# Altium project SLAP Board.PrjPcb
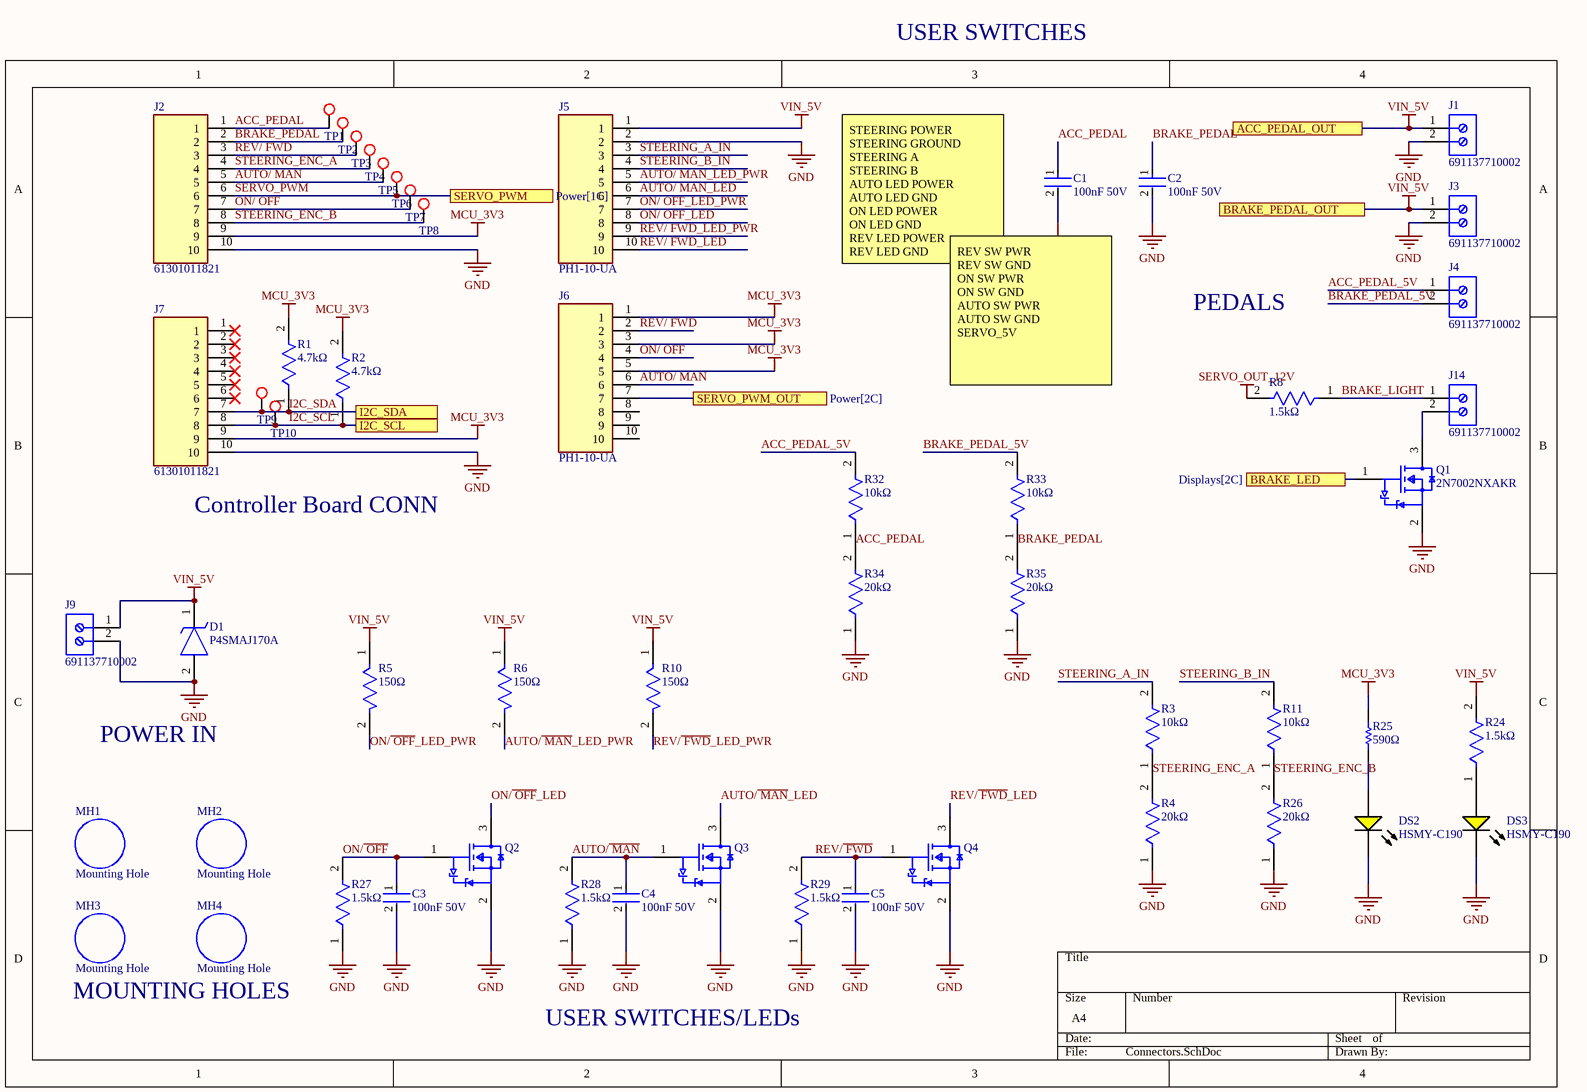
[diagram p0: Connectors.SchDoc]
3 sheets, 91 parts. Net scope: flat (ports and power ports of the same name join across sheets).
Board file: PCB1.PcbDoc
Sheets:
  Connectors.SchDoc
  Power.SchDoc
  Displays.SchDoc

## Sheet Connectors.SchDoc
size A4; SheetNumber: 1; SheetTotal: 3

### Parts
C1  100nF 50V  [FP-CL31-IPC_C]
C2  100nF 50V  [FP-CL31-IPC_C]
C3  100nF 50V  [FP-CL31-IPC_C]
C4  100nF 50V  [FP-CL31-IPC_C]
C5  100nF 50V  [FP-CL31-IPC_C]
D1  P4SMAJ170A  [DIOM5027X240N]
DS2  HSMY-C190  [AVAG-HSMX-C190_V]
DS3  HSMY-C190  [AVAG-HSMX-C190_V]
J1  691137710002  [691137710002]
J2  61301011821  [RHDR10W60P0X254_1X10_2590X250X850P]
J3  691137710002  [691137710002]
J4  691137710002  [691137710002]
J5  PH1-10-UA  [HDRV10W64P0X254_1X10_2540X249X886P]
J6  PH1-10-UA  [HDRV10W64P0X254_1X10_2540X249X886P]
J7  61301011821  [RHDR10W60P0X254_1X10_2590X250X850P]
J9  691137710002  [691137710002]
J14  691137710002  [691137710002]
MH1  Mounting Hole  [Mounting Hole]
MH2  Mounting Hole  [Mounting Hole]
MH3  Mounting Hole  [Mounting Hole]
MH4  Mounting Hole  [Mounting Hole]
Q1  2N7002NXAKR  [FP-SOT23-IPC_B]
Q2  2N7002NXAKR  [FP-SOT23-IPC_B]  (value not drawn)
Q3  2N7002NXAKR  [FP-SOT23-IPC_B]  (value not drawn)
Q4  2N7002NXAKR  [FP-SOT23-IPC_B]  (value not drawn)
R1  4.7kΩ  [FP-RT0805-MFG]
R2  4.7kΩ  [FP-RT0805-MFG]
R3  10kΩ  [FP-RT0603-MFG]
R4  20kΩ  [FP-RT0805-MFG]
R5  150Ω  [FP-RT0603-MFG]
R6  150Ω  [FP-RT0603-MFG]
R8  1.5kΩ  [FP-CRCW0603-e3-IPC_A]  (no BOM)
R10  150Ω  [FP-RT0603-MFG]
R11  10kΩ  [FP-RT0603-MFG]
R24  1.5kΩ  [FP-RC1608-IPC_B]
R25  590Ω  [RESC1608X55X25ML10T15]
R26  20kΩ  [FP-RT0805-MFG]
R27  1.5kΩ  [FP-CRCW0603-e3-IPC_A]
R28  1.5kΩ  [FP-CRCW0603-e3-IPC_A]
R29  1.5kΩ  [FP-CRCW0603-e3-IPC_A]
R32  10kΩ  [FP-RT0603-MFG]
R33  10kΩ  [FP-RT0603-MFG]
R34  20kΩ  [FP-RT0805-MFG]
R35  20kΩ  [FP-RT0805-MFG]
TP1  TP  [Testpoint]  (value not drawn)
TP2  TP  [Testpoint]  (value not drawn)
TP3  TP  [Testpoint]  (value not drawn)
TP4  TP  [Testpoint]  (value not drawn)
TP5  TP  [Testpoint]  (value not drawn)
TP6  TP  [Testpoint]  (value not drawn)
TP7  TP  [Testpoint]  (value not drawn)
TP8  TP  [Testpoint]  (value not drawn)
TP9  TP  [Testpoint]  (value not drawn)
TP10  TP  [Testpoint]  (value not drawn)

### Ports
ACC_PEDAL_OUT, BRAKE_LED (see Displays[2C]), BRAKE_PEDAL_OUT, I2C_SCL (see Displays[1A], Displays[2C]), I2C_SDA (see Displays[1A], Displays[2C]), SERVO_PWM (see Power[1C]), SERVO_PWM_OUT (see Power[2C])

### Nets
GND: C1.2 C2.2 C3.2 C4.2 C5.2 D1.2(A) DS2.2(K) DS3.2(K) J1.2 J2.10 J3.2 J5.2 J7.10 J9.2 Q1.2(S) Q2.2(S) Q3.2(S) Q4.2(S) R4.1 R26.1 R27.1 R28.1 R29.1 R34.1 R35.1
MCU_3V3: J2.9 J6.1 J6.3 J6.5 J7.9 R1.2 R2.2 R25.2
SERVO_OUT_12V: R8.2
VIN_5V: D1.1(K) J1.1 J3.1 J5.1 J9.1 R5.1 R6.1 R10.1 R24.2 ; port ACC_PEDAL_OUT, port BRAKE_PEDAL_OUT
ACC_PEDAL: C1.1 J2.1 R32.1 R34.2 TP1.0
ACC_PEDAL_5V: J4.1 R32.2
AUTO/~{ MAN}: C4.1 J2.5 J6.6 Q3.1(G) R28.2 TP5.0
AUTO/~{ MAN}_LED: J5.6 Q3.3(D)
AUTO/~{ MAN}_LED_PWR: J5.5 R6.2
BRAKE_LED: Q1.1(G) ; port BRAKE_LED
BRAKE_LIGHT: J14.1 R8.1
BRAKE_PEDAL: C2.1 J2.2 R33.1 R35.2 TP2.0
BRAKE_PEDAL_5V: J4.2 R33.2
I2C_SCL: J7.8 R2.1 TP10.0 ; port I2C_SCL
I2C_SDA: J7.7 R1.1 TP9.0 ; port I2C_SDA
ON/~{ OFF}: C3.1 J2.7 J6.4 Q2.1(G) R27.2 TP7.0
ON/~{ OFF}_LED: J5.8 Q2.3(D)
ON/~{ OFF}_LED_PWR: J5.7 R5.2
REV/~{ FWD}: C5.1 J2.3 J6.2 Q4.1(G) R29.2 TP3.0
REV/~{ FWD}_LED: J5.10 Q4.3(D)
REV/~{ FWD}_LED_PWR: J5.9 R10.2
SERVO_PWM: J2.6 TP6.0 ; port SERVO_PWM
STEERING_A_IN: J5.3 R3.2
STEERING_B_IN: J5.4 R11.2
STEERING_ENC_A: J2.4 R3.1 R4.2 TP4.0
STEERING_ENC_B: J2.8 R11.1 R26.2 TP8.0
NetDS2_1: DS2.1(A) R25.1
NetDS3_1: DS3.1(A) R24.1
NetIC2_4: J6.7 ; port SERVO_PWM_OUT
NetJ14_2: J14.2 Q1.3(D)

Not connected (* = marked no-connect by the designer): J6 8 9 10; J7 1* 2* 3* 4* 5* 6*

### Notes on the sheet
- USER SWITCHES
- STEERING POWER
  STEERING GROUND
  STEERING A
  STEERING B
  AUTO LED POWER
  AUTO LED GND
  ON LED POWER
  ON LED GND
  REV LED POWER
  REV LED GND
- PEDALS
- REV SW PWR
  REV SW GND
  ON SW PWR
  ON SW GND
  AUTO SW PWR
  AUTO SW GND
  SERVO_5V
- (near J7) Controller Board CONN
- POWER IN
- MOUNTING HOLES
- USER SWITCHES/LEDs

### Library data of the parts
C1-C5 = CMP-13271-001276-1: Cap Ceramic 100nF 50V X7R ±10% SMD 1206 +125°C Embossed T/R; Dielectric: X7R; Case Code (Metric): 3216; Package Quantity: 1; Thickness: 0.037inch; Depth: 1.6mm; Packaging: Tape and Reel; Capacitance: 100nF; Length: 0.126inch; Tolerance: 10%; Voltage Rating: 50V; Case Code (Imperial): 1206; Radiation Hardening: No; Width: 0.063inch; Case/Package: 1206; Max Operating Temperature: 125°C; Min Operating Temperature: -55°C; Height: 0.85mm; Mount: Surface Mount
D1 = P4SMAJ170A: TVS Diode (Uni-directional); Manufacturer_Name: Diotec; Datasheet Link: https://diotec.com/request/datasheet/p4smaj65.pdf; Height: 2.4mm; Manufacturer_Part_Number: P4SMAJ170A
DS2 DS3 = CMP-1744-00003-1: LED Uni-Color Yellow, 65 mW, 20 mA, -40 to 85 degC, 2-Pin SMD, RoHS, Tape and Reel; Tolerance: 1%; Voltage Rating: 50 V; Power Rating: 100 mW; Case\Package: 0603; Resistance: 390 Ohm; Min Operating Temperature: -55 degC; Length: 1.6 mm; ComponentLink3Description: Package Specification; Mount: Surface Mount; PackageReference: HSMX-C190; ComponentLink2Description: Datasheet; DatasheetVersion: Mar-12; Case Code (Metric): 1608; Pins: 2; Package Quantity: 5000; ComponentLink2URL: http://docs.avagotech.com/docs/AV02-0551EN; ComponentLink1Description: Manufacturer URL; RoHSCompliant: true; Packaging: Tape and Reel; PackageDescription: 2-Pin Surface Mount Device, Body 1.6 x 0.8 mm, Height 0.9 mm; REACH SVHC: No SVHC; ComponentLink3URL: http://www.fairchildsemi.com/dwg/MA/MA03D.pdf; Voltage Rating (DC): 50 V; Width: 0.8 mm; ComponentLink1URL: http://www.avagotech.com/; Max Operating Temperature: 155 degC; Case Code (Imperial): 0603; Height: 0.45 mm
J1 J3 J4 J9 J14 = CMP-1502-03324-2: NexarPartId: 78871135; Voltage Rating: 300V; Number of Contacts: 2; Current Rating: 16A; Lead Pitch: 5mm; Height: 11.6mm; Packaging: Box; RoHS: Non-Compliant; Contact Material: Nickel, Tin; Max Operating Temperature: 120°C; Number of Pins: 2; Min Operating Temperature: -30°C; Number of Rows: 1
J2 J7 = 61301011821: Connector; Manufacturer_Name: Wurth Elektronik; Datasheet Link: http://katalog.we-online.de/em/datasheet/6130xx11821.pdf; Height: 8.5mm; Manufacturer_Part_Number: 61301011821; Mouser Part Number: 710-61301011821; Mouser Price/Stock: https://www.mouser.co.uk/ProductDetail/Wurth-Elektronik/61301011821?qs=W%252B2sBeLta1ZhlLR0YCzonQ%3D%3D
J5 J6 = PH1-10-UA: Connector; Manufacturer_Name: Adam Tech; Datasheet Link: https://app.adam-tech.com/products/download/data_sheet/201605/ph1-xx-ua-data-sheet.pdf; Height: 8.865mm; Manufacturer_Part_Number: PH1-10-UA; Mouser Part Number: 737-PH1-10-UA; Mouser Price/Stock: https://www.mouser.co.uk/ProductDetail/Adam-Tech/PH1-10-UA?qs=ogqIPVdloe%252Bff9mnAAAy9w%3D%3D; Arrow Part Number: PH1-10-UA; Arrow Price/Stock: null?utm_currency=USD&region=nac
Q1-Q4 = CMP-14409-000026-2: 2N7002NXAK/SOT23/TO-236AB
R1 R2 = CMP-03412-019393-1: RES SMD 4.7K OHM 1% 1/8W 0805; Manufacturer Part Number: RT0805FRE074K7L; Manufacturer: Yageo; Tolerance: 0.0001; Power Rating: 0.125W; Voltage Rating: 150V; Temperature Coefficient: 50 ppm/°C; Device Class L1: Passive Components; Category: Res; Temperature Range Low: -55°C; Device Class L2: Resistors; Ipc Land Pattern Name: RESC200125X50; Package: RT0805; Device Class L3: Chip SMD Resistors; Temperature: -55°C to +155°C; ComponentLink2Description: Datasheet; Footprint Url: http://www.yageo.com/exep/pages/download/literatures/PYu-R_Mount_10.pdf; Series: RT; Mouser Description: Thin Film Resistors - SMD 1/8W 4.7K ohm 1% 50ppm; Height: 0.6mm; Resistance: 4.7KΩ; Octopart: https://octopart.com/rt0805fre074k7l-yageo-40047233; Value: 4.7KΩ; Digikey Description: RES SMD 4.7K OHM 1% 1/8W 0805; Composition: Thin Film; Automotive: No; Temperature Range High: +155°C; Lead Free: Yes; ComponentLink2URL: http://www.yageo.com/documents/recent/PYu-RT_1-to-0.01_RoHS_L_9.pdf; RoHS: TRUE
R3 R11 R32 R33 = CMP-2000-04517-2: RES SMD 10K OHM 0.1% 1/10W 0603; Manufacturer Part Number: RT0603BRE0710KL; Manufacturer: Yageo; Tolerance: 0.001; Temperature Coefficient: 50 ppm/°C; Power Rating: 0.1W; Voltage Rating: 75V; Temperature Range High: +155°C; Device Class L2: Resistors; Temperature: -55°C to +155°C; Series: RT; Device Class L1: Passive Components; Temperature Range Low: -55°C; Automotive: No; Mouser Description: Res Thin Film 0603 10K Ohm 0.1% 1/10W ±50ppm/°C Molded SMD SMD Paper T/R; Device Class L3: Chip SMD Resistors; RoHS: TRUE; Package: RT0603; Footprint Url: http://www.yageo.com/exep/pages/download/literatures/PYu-R_Mount_10.pdf; Octopart: https://octopart.com/rt0603bre0710kl-yageo-1273959; ComponentLink2URL: http://www.yageo.com/documents/recent/PYu-RT_1-to-0.01_RoHS_L_9.pdf; Composition: Thin Film; Category: Res; Lead Free: Yes; Resistance: 10KΩ; Height: 0.55mm; Digikey Description: RES SMD 10K OHM 0.1% 1/10W 0603; Ipc Land Pattern Name: RESC16080X45; Value: 10KΩ; ComponentLink2Description: Datasheet
R4 R26 R34 R35 = CMP-2001-01463-2: RES SMD 20K OHM 1% 1/8W 0805; Manufacturer: Yageo; Manufacturer Part Number: RT0805FRE0720KL; Power Rating: 0.125W; Voltage Rating: 150V; Tolerance: 0.0001; Temperature Coefficient: 50 ppm/°C; Height: 0.6mm; Lead Free: Yes; Device Class L3: Chip SMD Resistors; Series: RT; ComponentLink2URL: http://www.yageo.com/documents/recent/PYu-RT_1-to-0.01_RoHS_L_9.pdf; Footprint Url: http://www.yageo.com/exep/pages/download/literatures/PYu-R_Mount_10.pdf; Value: 20KΩ; Mouser Description: Thin Film Resistors - SMD 1/8W 20K ohm 1% 50ppm; Device Class L2: Resistors; Device Class L1: Passive Components; RoHS: TRUE; ComponentLink2Description: Datasheet; Category: Res; Package: RT0805; Digikey Description: RES SMD 20K OHM 1% 1/8W 0805; Temperature Range High: +155°C; Ipc Land Pattern Name: RESC200125X50; Temperature Range Low: -55°C; Octopart: https://octopart.com/rt0805fre0720kl-yageo-1410620; Resistance: 20KΩ; Temperature: -55°C to +155°C; Composition: Thin Film; Automotive: No
R5 R6 R10 = CMP-03412-008371-1: RES SMD 150 OHM 1% 1/10W 0603; Manufacturer Part Number: RT0603FRE07150RL; Manufacturer: Yageo; Voltage Rating: 75V; Power Rating: 0.1W; Tolerance: 0.01; Temperature Coefficient: 50 ppm/°C; Digikey Description: RES SMD 150 OHM 1% 1/10W 0603; Device Class L3: Chip SMD Resistors; Category: Res; Automotive: No; Octopart: https://octopart.com/rt0603fre07150rl-yageo-39804552; Ipc Land Pattern Name: RESC16080X45; RoHS: TRUE; Composition: Thin Film; Lead Free: Yes; Temperature: -55°C to +155°C; Footprint Url: http://www.yageo.com/exep/pages/download/literatures/PYu-R_Mount_10.pdf; ComponentLink2URL: http://www.yageo.com/documents/recent/PYu-RT_1-to-0.01_RoHS_L_9.pdf; Device Class L1: Passive Components; ComponentLink2Description: Datasheet; Device Class L2: Resistors; Temperature Range Low: -55°C; Height: 0.55mm; Resistance: 150Ω; Package: RT0603; Series: RT; Temperature Range High: +155°C; Mouser Description: Thin Film Resistors - SMD 1/10W 150 ohm 1% 50ppm; Value: 150Ω
R8 R27-R29 = CMP-2000-02995-2: RES Thick Film, 1.5kΩ, 1%, 0.1W, 100ppm/°C, 0603; Working Voltage: 75V; Power Rating: 100mW; Resistance: 1.5kR; Max Operating Temperature: 155°C; Features: Automotive AEC-Q200; Min Operating Temperature: -55°C; Width: 0.033inch; Case/Package: 0603; Voltage Rating (DC): 75V; Termination: SMD/SMT; Mount: Surface Mount; Weight: 7.1E-05oz; Case Code (Metric): 1608; Height: 0.45mm; Voltage Rating: 75V; Length: 1.55mm; Package Quantity: 10; Lead Free: Lead Free; Composition: Thick Film; Packaging: Tape and Reel; Temperature Coefficient: 100ppm/°C; Tolerance: 1%; Military Standard: Not; Case Code (Imperial): 0603; Number of Terminations: 2; Max Power Dissipation: 100mW; Depth: 0.85mm; Contact Plating: Tin
R24 = CMP-13261-004935-1: Res Thick Film 0603 1.5kΩ 1% 0.1W ±100ppm/°C Molded SMD T/R; Resistance: 1.5kR; Voltage Rating (DC): 50V; Power Rating: 100mW; Contact Plating: Tin; Depth: 0.8mm; Width: 800um; Tolerance: 1%; Lead Free: Lead Free; Composition: Thick Film; Military Standard: Not; Temperature Coefficient: 100ppm/°C; Radiation Hardening: No; Length: 1.6mm; Case/Package: 0603; Max Operating Temperature: 155°C; Packaging: Tape and Reel; Min Operating Temperature: -55°C
R25 = CMP-2000-04089-1: Part Number: RC0603FR-07590RL; Manufacturer: Yageo
TP1-TP10 = Testpoint

## Sheet Power.SchDoc
size A4; SheetNumber: 2; SheetTotal: 3
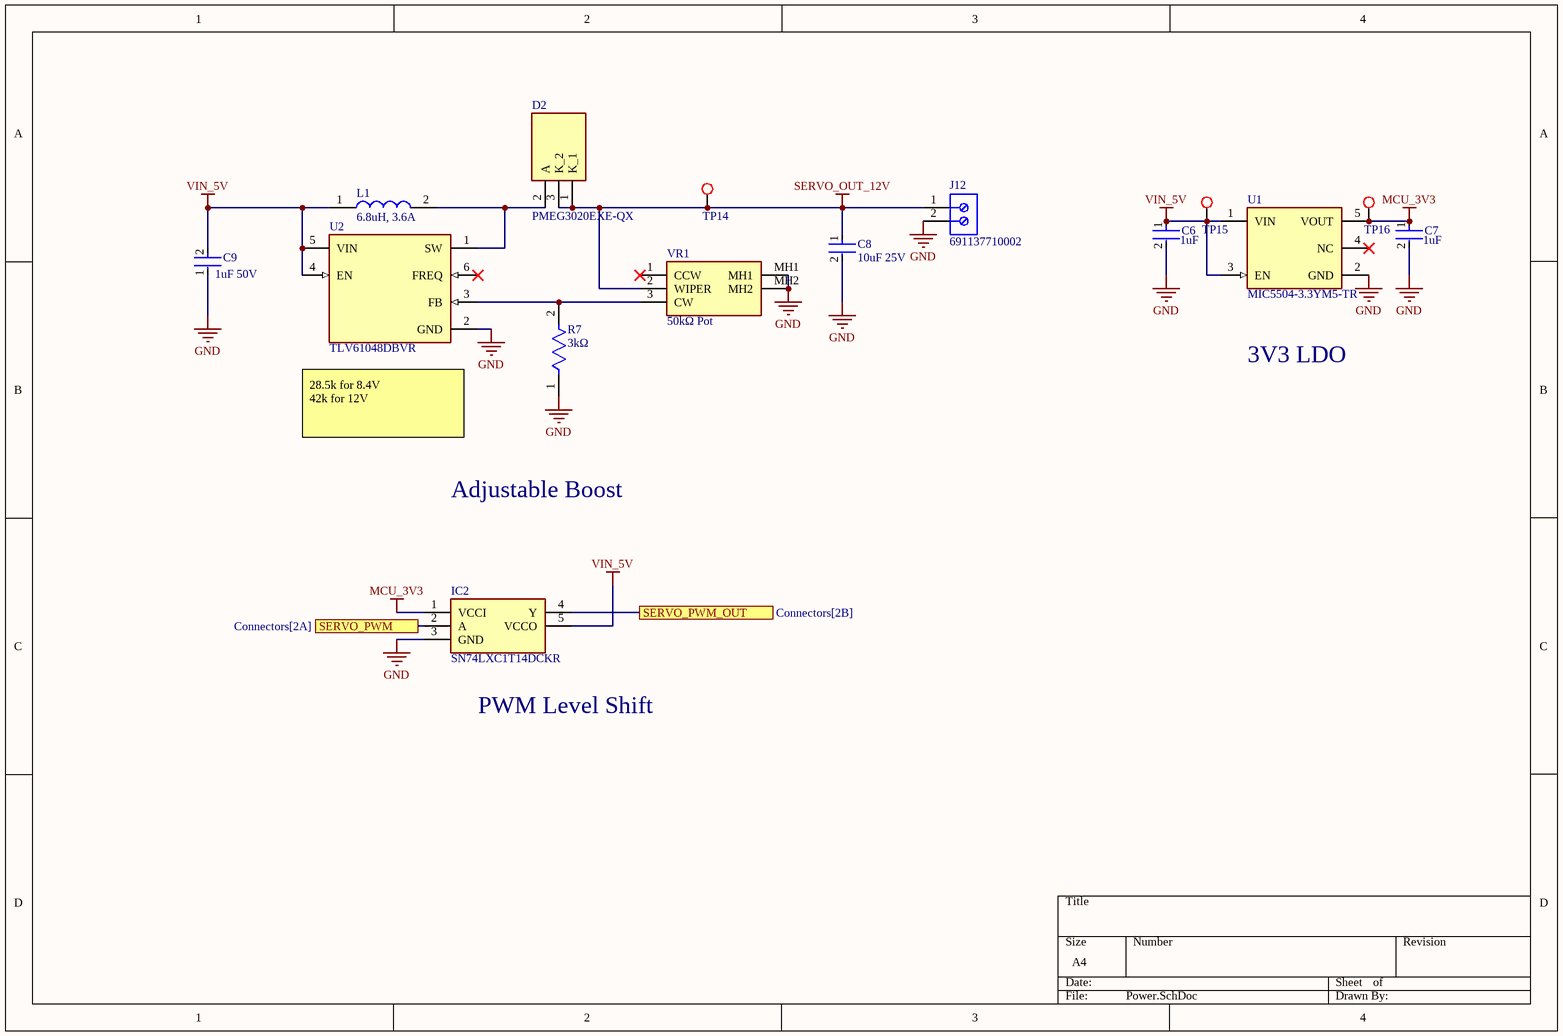
[diagram p1: Power.SchDoc]

### Parts
C6  1uF  [FP-CL10-IPC_C]
C7  1uF  [FP-CL10-IPC_C]
C8  10uF 25V  [FP-CL31-IPC_B]
C9  1uF 50V  [FP-C1608-080-0_1-IPC_B]
D2  PMEG3020EXE-QX  [PMEG4010EXEX]
IC2  SN74LXC1T14DCKR  [SOT65P210X110-5N]
J12  691137710002  [691137710002]
L1  6.8uH, 3.6A  [VLS6045]
R7  3kΩ  [FP-RG2012-IPC_A]
TP14  TP  [Testpoint]  (value not drawn)
TP15  TP  [Testpoint]  (value not drawn)
TP16  TP  [Testpoint]  (value not drawn)
U1  MIC5504-3.3YM5-TR  [FP-SOT23-5LD-PL-1-MFG]
U2  TLV61048DBVR  [FP-DBV0006A-IPC_B]
VR1  50kΩ Pot  [PTV09A4030SA503]

### Ports
SERVO_PWM (see Connectors[2A]), SERVO_PWM_OUT (see Connectors[2B])

### Nets
GND: C6.2 C7.2 C8.2 C9.1 IC2.3(GND) J12.2 R7.1 U1.2(GND) U2.2(GND) VR1.MH1 VR1.MH2
MCU_3V3: C7.1 IC2.1(VCCI) TP16.0 U1.5(VOUT)
SERVO_OUT_12V: C8.1 D2.1(K_1) D2.3(K_2) J12.1 TP14.0 VR1.2(WIPER)
VIN_5V: C6.1 C9.2 IC2.5(VCCO) L1.1 TP15.0 U1.1(VIN) U1.3(EN) U2.4(EN) U2.5(VIN)
SERVO_PWM: IC2.2(A) ; port SERVO_PWM
NetD2_2: D2.2(A) L1.2 U2.1(SW)
NetIC2_4: IC2.4(Y) ; port SERVO_PWM_OUT
NetR7_2: R7.2 U2.3(FB) VR1.3(CW)

Not connected (* = marked no-connect by the designer): U1 4(NC)*; U2 6(FREQ)*; VR1 1(CCW)*

### Notes on the sheet
- 3V3 LDO
- (near U2) 28.5k for 8.4V
  42k for 12V
- Adjustable Boost
- PWM Level Shift

### Library data of the parts
C6 C7 = CMP-13271-003399-1: Cap Ceramic 1uF 10V X5R ±10% Pad SMD 0603 +85°C T/R; Min Operating Temperature: -55°C; Max Operating Temperature: 85°C; Dielectric: X5R; Contact Plating: Tin; Height: 0.8mm; Voltage: 10V; Packaging: Tape and Reel; Voltage Rating: 10V; Capacitance: 1uF; Package Quantity: 1; Width: 0.031inch; Length: 1.6mm; Depth: 0.8mm; Case/Package: 0603; Case Code (Imperial): 0603; Thickness: 0.035inch; Radiation Hardening: No; Tolerance: 10%; Case Code (Metric): 1608; Mount: Surface Mount
C8 = CMP-13271-001434-1: Cap Ceramic 10uF 25V X7R ±10% SMD 1206 +125°C Embossed T/R; Max Operating Temperature: 125°C; Dielectric: X7R; Voltage Rating: 25V; Tolerance: 10%; Min Operating Temperature: -55°C; Height: 1.6mm; Mount: Surface Mount; Width: 0.063inch; Thickness: 0.071inch; Case Code (Metric): 3216; Contact Plating: Tin; Packaging: Tape and Reel; Case/Package: 1206; Capacitance: 10uF; Case Code (Imperial): 1206; Length: 0.126inch; Radiation Hardening: No; Package Quantity: 1; Depth: 1.6mm
C9 = CMP-2000-06025-2: Multilayer Ceramic Capacitors 1μF ±10% 50V X5R SMD 0603; Lead Free: Lead Free; Height: 0.8mm; Mount: Surface Mount; Radiation Hardening: No; Thickness: 0.035inch; Length: 1.6mm; Max Operating Temperature: 85°C; REACH SVHC: No SVHC; Min Operating Temperature: -55°C; Construction: Flat; RoHS Compliant: Yes; Voltage Rating: 50V; Dielectric: X5R; Packaging: Tape and Reel; Termination: SMD/SMT; Voltage Rating (DC): 50V; Case Code (Imperial): 0603; Voltage: 50V; Width: 0.031inch; Weight: 7.1E-05oz; Capacitance: 1uF; Depth: 0.8mm; Case Code (Metric): 1608; Series: C; Case/Package: 0603; Tolerance: 10%; Resistor Type: Ceramic; Number of Pins: 2; Dielectric Material: Ceramic; Package Quantity: 1
D2 = PMEG3020EXE-QX: Schottky Diode; Manufacturer_Name: Nexperia; Datasheet Link: https://assets.nexperia.com/documents/data-sheet/PMEG4010EXE.pdf; Height: 1mm; Manufacturer_Part_Number: PMEG3020EXE-QX; Mouser Part Number: 771-PMEG3020EXE-Q; Mouser Price/Stock: https://www.mouser.co.uk/ProductDetail/Nexperia/PMEG3020EXE-QX?qs=dbcCsuKDzFVlrH7wpIOIMQ%3D%3D
IC2 = SN74LXC1T14DCKR: Integrated Circuit; Manufacturer_Name: Texas Instruments; Datasheet Link: https://www.ti.com/lit/gpn/sn74lxc1t14; Height: 1.1mm; Manufacturer_Part_Number: SN74LXC1T14DCKR; Mouser Part Number: 595-SN74LXC1T14DCKR; Mouser Price/Stock: https://www.mouser.co.uk/ProductDetail/Texas-Instruments/SN74LXC1T14DCKR?qs=tlsG%2FOw5FFhO0IEgLqYGiw%3D%3D; Arrow Part Number: SN74LXC1T14DCKR; Arrow Price/Stock: https://www.arrow.com/en/products/sn74lxc1t14dckr/texas-instruments?region=nac
J12 = CMP-1502-03324-2: as J1 on sheet Connectors; Lead Pitch: 5mm; Height: 11.6mm; Packaging: Box; RoHS: Non-Compliant; Contact Material: Nickel, Tin; Max Operating Temperature: 120°C; Number of Pins: 2; Min Operating Temperature: -30°C; Number of Rows: 1
L1 = VLS6045EX-6R8M: Inductor; Manufacturer_Name: TDK; Datasheet Link: https://product.tdk.com/system/files/dam/doc/product/inductor/inductor/smd/catalog/inductor_commercial_power_vls6045ex_en.pdf; Manufacturer_Part_Number: VLS6045EX-6R8M; Mouser Part Number: 810-VLS6045EX-6R8M; Mouser Price/Stock: https://www.mouser.co.uk/ProductDetail/TDK/VLS6045EX-6R8M?qs=LtAzLad%252BoeXmJR68%2FnJvXA%3D%3D; Arrow Part Number: VLS6045EX-6R8M; Arrow Price/Stock: https://www.arrow.com/en/products/vls6045ex-6r8m/tdk?utm_currency=USD&region=nac
R7 = CMP-2001-02900-2: Automotive Metal Thin Film Chip Resistor, 0805, 3kΩ, 0.1%, 25ppm/°C, 0.125W, 150V; Resistance: 3kR; Max Power Dissipation: 125mW; Voltage Rating: 100V; Power Rating: 100mW; Width: 1.25mm; Case/Package: 0805; Resistor Type: Thin Film; Case Code (Metric): 2012; Min Operating Temperature: -55°C; Series: RG; Length: 0.079inch; Temperature Coefficient: 25ppm/°C; Height: 0.02inch; Number of Terminations: 2; RoHS Compliant: Yes; Termination: SMD/SMT; Packaging: Tape and Reel; Max Operating Temperature: 155°C; Package Quantity: 1; Size Code: 0805; Case Code (Imperial): 0805; Lead Free: Lead Free; Voltage Rating (DC): 150V; Tolerance: 0.1%; Features: Automotive AEC-Q200
TP14-TP16 = Testpoint
U1 = CMP-2000-07604-2: IC REG LINEAR 3.3V 300MA SOT23-5; Quiescent Current: 38uA; Operating Supply Current: 42uA; Max Input Voltage: 5.5V; Min Input Voltage: 2.5V; Output Type: Fixed; Power Supply Rejection Ratio (PSRR): 60dB; Dropout Voltage: 380mV; Accuracy: 3%; Number of Outputs: 1; Nominal Output Voltage: 3.3V; Max Output Current: 300mA; Length: 2.9mm; Mount: Surface Mount; Width: 1.6mm; Packaging: Tape and Reel; Output Current: 300mA; Min Operating Temperature: -40°C; Max Operating Temperature: 125°C; Height: 1.1mm; Case/Package: SOT-23-5; REACH SVHC: No SVHC; Number of Pins: 5; Output Voltage: 3.3V
U2 = CMP-04918-000262-1: IC REG BOOST ADJ SOT23-6
VR1 = PTV09A-4030S-A503: Variable Resistor; Manufacturer_Name: Bourns; Datasheet Link: https://www.bourns.com/docs/Product-Datasheets/PTV09.pdf; Height: 30.5mm; Manufacturer_Part_Number: PTV09A-4030S-A503; Mouser Part Number: 652-PTV09A-4030SA503; Mouser Price/Stock: https://www.mouser.co.uk/ProductDetail/Bourns/PTV09A-4030S-A503?qs=pxDZlBjcsCjgtyjThPtRRg%3D%3D

## Sheet Displays.SchDoc
size A4; SheetNumber: 3; SheetTotal: 3
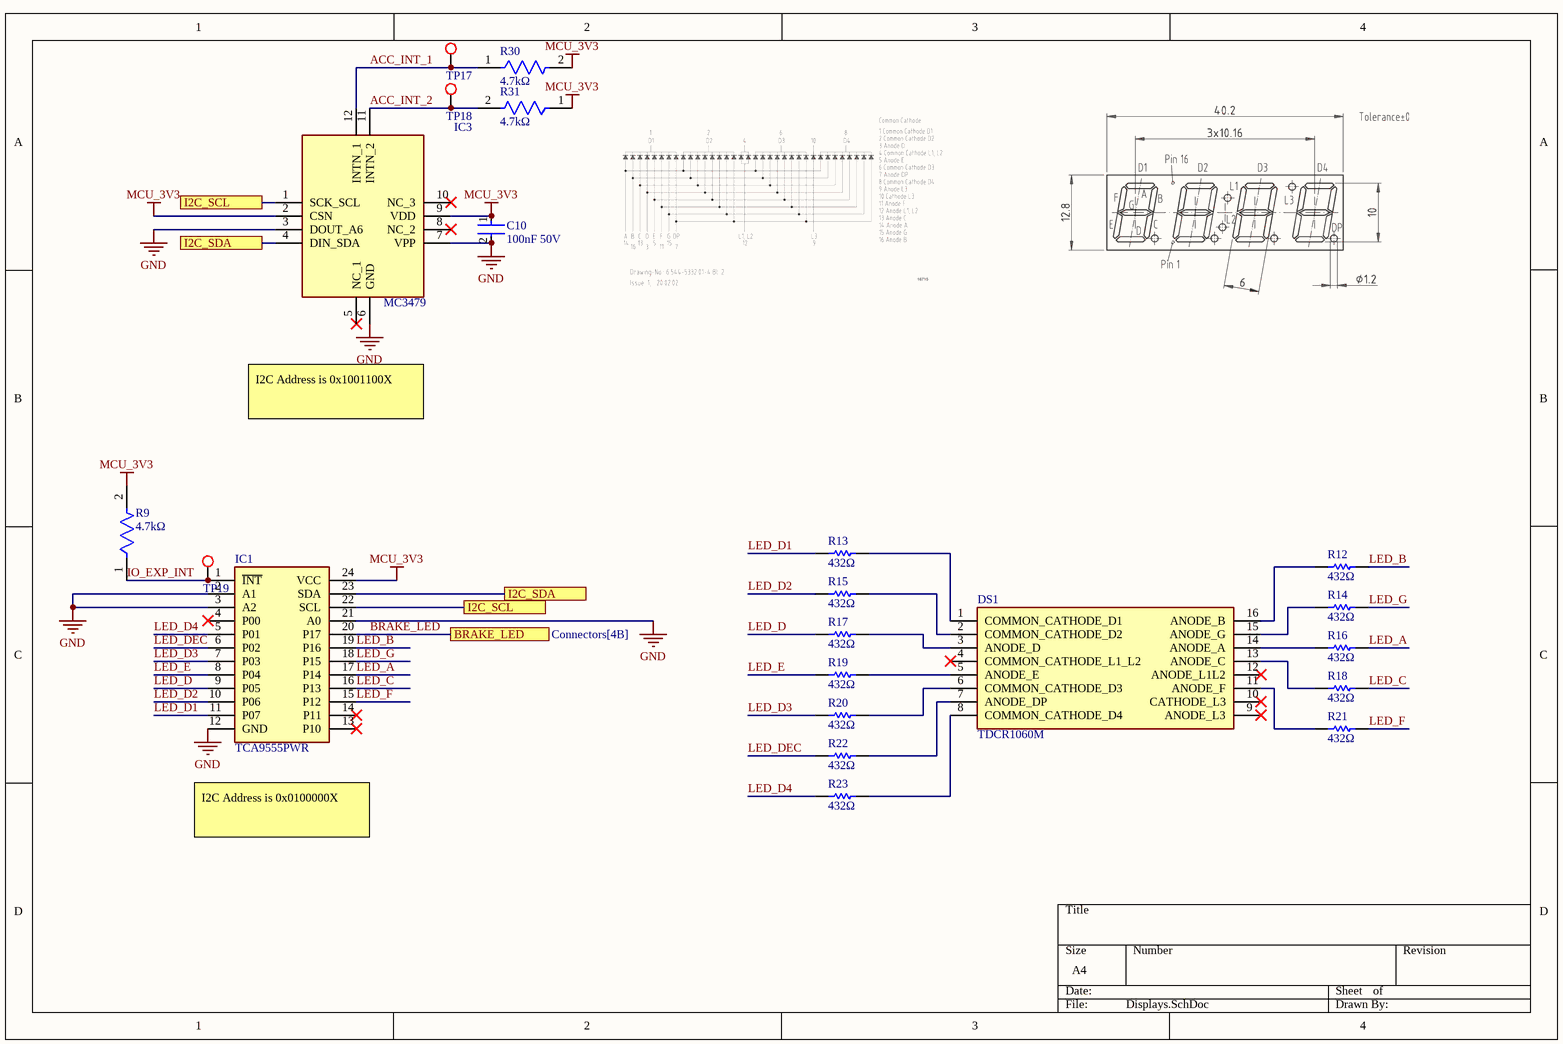
[diagram p2: Displays.SchDoc]

### Parts
C10  100nF 50V  [FP-CL31-IPC_C]
DS1  TDCR1060M  [DIPS1016W50P254L4020H725Q16N]
IC1  TCA9555PWR  [SOP65P640X120-24N]
IC3  MC3479  [MC3479]
R9  4.7kΩ  [FP-RT0805-MFG]
R12  432Ω  [RESC2013X50X30NL20T20]
R13  432Ω  [RESC2013X50X30NL20T20]
R14  432Ω  [RESC2013X50X30NL20T20]
R15  432Ω  [RESC2013X50X30NL20T20]
R16  432Ω  [RESC2013X50X30NL20T20]
R17  432Ω  [RESC2013X50X30NL20T20]
R18  432Ω  [RESC2013X50X30NL20T20]
R19  432Ω  [RESC2013X50X30NL20T20]
R20  432Ω  [RESC2013X50X30NL20T20]
R21  432Ω  [RESC2013X50X30NL20T20]
R22  432Ω  [RESC2013X50X30NL20T20]
R23  432Ω  [RESC2013X50X30NL20T20]
R30  4.7kΩ  [FP-RT0805-MFG]
R31  4.7kΩ  [FP-RT0805-MFG]
TP17  TP  [Testpoint]  (value not drawn)
TP18  TP  [Testpoint]  (value not drawn)
TP19  TP  [Testpoint]  (value not drawn)

### Ports
BRAKE_LED (see Connectors[4B]), I2C_SCL (see Connectors[1B], Displays[1A]), I2C_SCL (see Connectors[1B], Displays[2C]), I2C_SDA (see Connectors[1B], Displays[1A]), I2C_SDA (see Connectors[1B], Displays[2C])

### Nets
GND: C10.2 IC1.2(A1) IC1.3(A2) IC1.12(GND) IC1.21(A0) IC3.3(DOUT_A6) IC3.6(GND) IC3.7(VPP)
MCU_3V3: C10.1 IC1.24(VCC) IC3.2(CSN) IC3.9(VDD) R9.2 R30.2 R31.1
ACC_INT_1: IC3.12(INTN_1) R30.1 TP17.0
ACC_INT_2: IC3.11(INTN_2) R31.2 TP18.0
BRAKE_LED: IC1.20(P17) ; port BRAKE_LED
I2C_SCL: IC1.22(SCL) IC3.1(SCK_SCL) ; port I2C_SCL
I2C_SDA: IC1.23(SDA) IC3.4(DIN_SDA) ; port I2C_SDA
IO_EXP_INT: IC1.1(~{INT}) R9.1 TP19.0
LED_A: IC1.17(P14) R16.2
LED_B: IC1.19(P16) R12.2
LED_C: IC1.16(P13) R18.2
LED_D: IC1.9(P05) R17.1
LED_D1: IC1.11(P07) R13.1
LED_D2: IC1.10(P06) R15.1
LED_D3: IC1.7(P03) R20.1
LED_D4: IC1.5(P01) R23.1
LED_DEC: IC1.6(P02) R22.1
LED_E: IC1.8(P04) R19.1
LED_F: IC1.15(P12) R21.2
LED_G: IC1.18(P15) R14.2
NetDS1_1: DS1.1(COMMON_CATHODE_D1) R13.2
NetDS1_2: DS1.2(COMMON_CATHODE_D2) R15.2
NetDS1_3: DS1.3(ANODE_D) R17.2
NetDS1_5: DS1.5(ANODE_E) R19.2
NetDS1_6: DS1.6(COMMON_CATHODE_D3) R20.2
NetDS1_7: DS1.7(ANODE_DP) R22.2
NetDS1_8: DS1.8(COMMON_CATHODE_D4) R23.2
NetDS1_11: DS1.11(ANODE_F) R21.1
NetDS1_13: DS1.13(ANODE_C) R18.1
NetDS1_14: DS1.14(ANODE_A) R16.1
NetDS1_15: DS1.15(ANODE_G) R14.1
NetDS1_16: DS1.16(ANODE_B) R12.1

Not connected (* = marked no-connect by the designer): DS1 4(COMMON_CATHODE_L1_L2)* 9(ANODE_L3)* 10(CATHODE_L3)* 12(ANODE_L1L2)*; IC1 4(P00)* 13(P10)* 14(P11)*; IC3 5(NC_1)* 8(NC_2)* 10(NC_3)*

### Notes on the sheet
- I2C Address is 0x1001100X
- I2C Address is 0x0100000X

### Library data of the parts
C10 = CMP-13271-001276-1: as C1 on sheet Connectors; Dielectric: X7R; Case Code (Metric): 3216; Package Quantity: 1; Thickness: 0.037inch; Depth: 1.6mm; Packaging: Tape and Reel; Capacitance: 100nF; Length: 0.126inch; Tolerance: 10%; Voltage Rating: 50V; Case Code (Imperial): 1206; Radiation Hardening: No; Width: 0.063inch; Case/Package: 1206; Max Operating Temperature: 125°C; Min Operating Temperature: -55°C; Height: 0.85mm; Mount: Surface Mount
DS1 = TDCR1060M: Display; Manufacturer_Name: Vishay; Datasheet Link: https://www.vishay.com/docs/83180/tdcx10x0m.pdf; Height: 7.25mm; Manufacturer_Part_Number: TDCR1060M; Mouser Part Number: 78-TDCR1060M; Mouser Price/Stock: https://www.mouser.co.uk/ProductDetail/Vishay-Semiconductors/TDCR1060M?qs=RzxYCzJDjPUXs69EkIPw9Q%3D%3D
IC1 = TCA9555PWR: Integrated Circuit; Manufacturer_Name: Texas Instruments; Datasheet Link: https://www.ti.com/lit/gpn/TCA9555; Height: 1.2mm; Manufacturer_Part_Number: TCA9555PWR; Mouser Part Number: 595-TCA9555PWR; Mouser Price/Stock: https://www.mouser.co.uk/ProductDetail/Texas-Instruments/TCA9555PWR?qs=O3wcJz4o8IeDwg4St4nEYQ%3D%3D; Arrow Part Number: TCA9555PWR; Arrow Price/Stock: https://www.arrow.com/en/products/tca9555pwr/texas-instruments?region=nac
IC3 = MC3479: Integrated Circuit; Manufacturer_Name: MEMSIC; Description: Accelerometers Small Digital 3-axis Accelerometer Sensor; Datasheet Link: http://www.memsic.com/uploadfiles/2020/08/20200827164636363.pdf; Height: 1mm; Manufacturer_Part_Number: MC3479; Mouser Part Number: 498-MC3479; Mouser Price/Stock: https://www.mouser.co.uk/ProductDetail/MEMSIC/MC3479?qs=OlC7AqGiEDmYmlaMvA9fTA%3D%3D; Arrow Part Number: MC3479; Arrow Price/Stock: null?region=nac
R9 R30 R31 = CMP-03412-019393-1: as R1 on sheet Connectors; Device Class L1: Passive Components; Category: Res; Temperature Range Low: -55°C; Device Class L2: Resistors; Ipc Land Pattern Name: RESC200125X50; Package: RT0805; Device Class L3: Chip SMD Resistors; Temperature: -55°C to +155°C; ComponentLink2Description: Datasheet; Footprint Url: http://www.yageo.com/exep/pages/download/literatures/PYu-R_Mount_10.pdf; Series: RT; Mouser Description: Thin Film Resistors - SMD 1/8W 4.7K ohm 1% 50ppm; Height: 0.6mm; Resistance: 4.7KΩ; Octopart: https://octopart.com/rt0805fre074k7l-yageo-40047233; Value: 4.7KΩ; Digikey Description: RES SMD 4.7K OHM 1% 1/8W 0805; Composition: Thin Film; Automotive: No; Temperature Range High: +155°C; Lead Free: Yes; ComponentLink2URL: http://www.yageo.com/documents/recent/PYu-RT_1-to-0.01_RoHS_L_9.pdf; RoHS: TRUE
R12-R23 = CMP-2001-03914-1: Part Number: CRCW0805432RFKEA; Manufacturer: Vishay Dale
TP17-TP19 = Testpoint

## Nets that join several sheets
GND: Connectors (25 pins), Power (11 pins), Displays (8 pins)
MCU_3V3: Connectors (8 pins), Power (C7.1 IC2.1 TP16.0 U1.5), Displays (7 pins)
SERVO_OUT_12V: Connectors (R8.2), Power (6 pins)
VIN_5V: Connectors (9 pins), Power (9 pins)
BRAKE_LED: Connectors (Q1.1), Displays (IC1.20)
I2C_SCL: Connectors (J7.8 R2.1 TP10.0), Displays (IC1.22 IC3.1)
I2C_SDA: Connectors (J7.7 R1.1 TP9.0), Displays (IC1.23 IC3.4)
NetIC2_4: Connectors (J6.7), Power (IC2.4)
SERVO_PWM: Connectors (J2.6 TP6.0), Power (IC2.2)